# EAGLE design rambo_e2p (EAGLE 6.4)
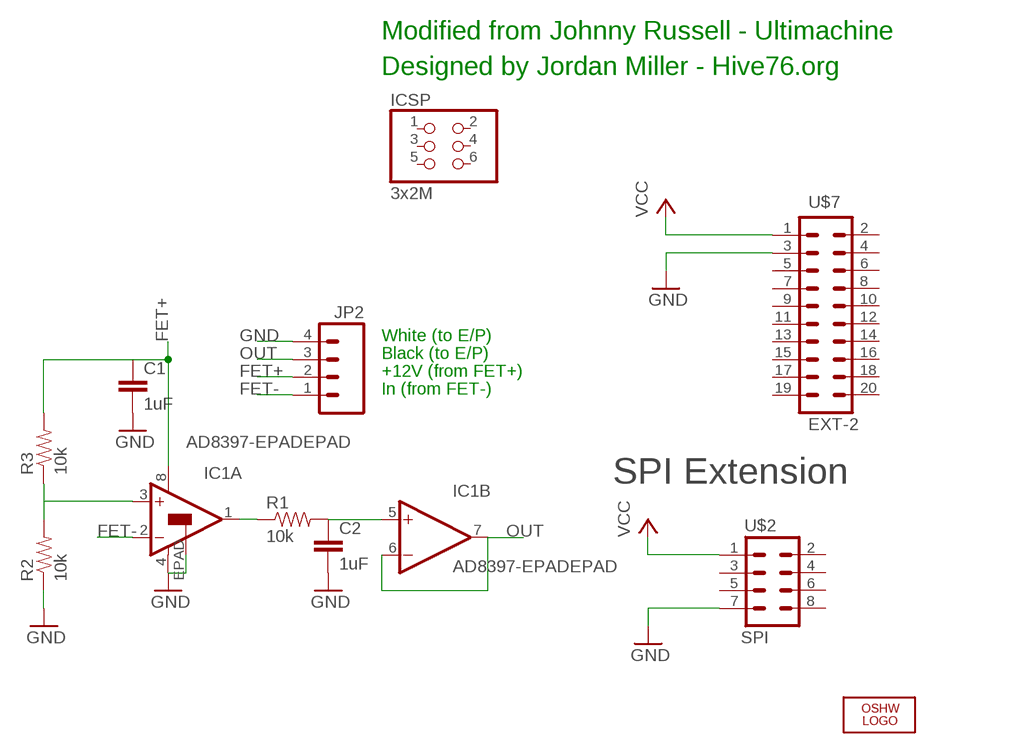
[diagram p0: schematic, sheet 1]

## Parts
C1  1uF  1UF-25V-10%(0805)  [0805]
C2  1uF  1UF-25V-10%(0805)  [0805]
IC1  AD8397-EPADEPAD  [SO08-EPAD]
ICSP  3x2M  PINHD-2X3  [2X03]
JP2  M04SCREW  [SCREWTERMINAL-3.5MM-4]
LOGO1  OSHW_LOGO_8MILX0150-NT  [OSHW_8X150_NOTEXT]
R1  10k  RESISTOR0805-RES  [0805]
R2  10k  RESISTOR0805-RES  [0805]
R3  10k  RESISTOR0805-RES  [0805]
U$2  SPI  M04X2  [2X4]
U$7  EXT-2  M10X2  [2X10]

## Nets
FET+: C1.1 IC1.8(A:V+) JP2.2 R3.2
FET-: IC1.2(A:-IN) JP2.1
GND [gnd]: C1.2 C2.2 IC1.4(A:V-) IC1.EPAD(A:EPAD) JP2.4 R2.1 U$2.7 U$7.3
N$1: IC1.1(A:OUT) R1.1
N$2: C2.1 IC1.5(B:+IN) R1.2
N$5: IC1.3(A:+IN) R2.2 R3.1
OUT: IC1.6(B:-IN) IC1.7(B:OUT) JP2.3
VCC: U$2.1 U$7.1
Unconnected: ICSP.1 ICSP.2 ICSP.3 ICSP.4 ICSP.5 ICSP.6 U$2.2 U$2.3 U$2.4 U$2.5 U$2.6 U$2.8 U$7.2 U$7.4 U$7.5 U$7.6 U$7.7 U$7.8 U$7.9 U$7.10 U$7.11 U$7.12 U$7.13 U$7.14 U$7.15 U$7.16 U$7.17 U$7.18 U$7.19 U$7.20

## Notes on the sheet
- Modified from Johnny Russell - Ultimachine
- Designed by Jordan Miller - Hive76.org
- White (to E/P)
- Black (to E/P)
- +12V (from FET+)
- In (from FET-)
- SPI Extension

## Library data of the parts
C1 C2 = SparkFun-Capacitors:1UF-25V-10%(0805): CAP-08064; PROD_ID: CAP-08064
IC1 = SparkFun-AnalogIC:AD8397-EPAD: Rail-to-rail high current output op-amp
ICSP = SmartPrj:PINHD-2X3: PIN HEADER
JP2 = SparkFun-Connectors:M04: Header 4 Standard 4-pin 0.1" header. Use with straight break away headers (SKU : PRT-00116), right angle break away headers (PRT-00553), swiss pins (PRT-00743), machine pins (PRT-00117), and female headers (PRT-00115). Molex polarized connector foot print use with SKU : PRT-08231 with associated crimp pins and housings. 1MM SMD Version SKU: PRT-10208
LOGO1 = ohw-logo:OSHW_LOGO_8MIL
R1-R3 = SparkFun-Resistors:RESISTOR: Resistor Basic schematic elements and footprints for 0603, 1206, and PTH resistors.
U$2 = SparkFun:M04X2
U$7 = SparkFun:M10X2: This was SPECIALLY designed to be used with our Graphic LCD Backpack. Be sure you want to use this! It is not only staggered on each line of header holes, but IT IS ALSO offset of the center point of the top and bottom lines by 5 mil. This causes the headers to lock into place on the "standard" footprint on the LCD screen. The extra squares on the tdocu layer are there simply to reference other pins (if you were to actually populate a longer header than ten long - this is what we do with the backpacks).

## Net classes
0 default: width 0.178 mm, drill 0.381 mm, clearance 0.178 mm
1 power: width 0.203 mm, drill 0.381 mm, clearance 0.178 mm
2 gnd: width 0.203 mm, drill 0.381 mm, clearance 0.178 mm
3 power usb: width 0.203 mm, drill 0.381 mm, clearance 0.178 mm

## Board
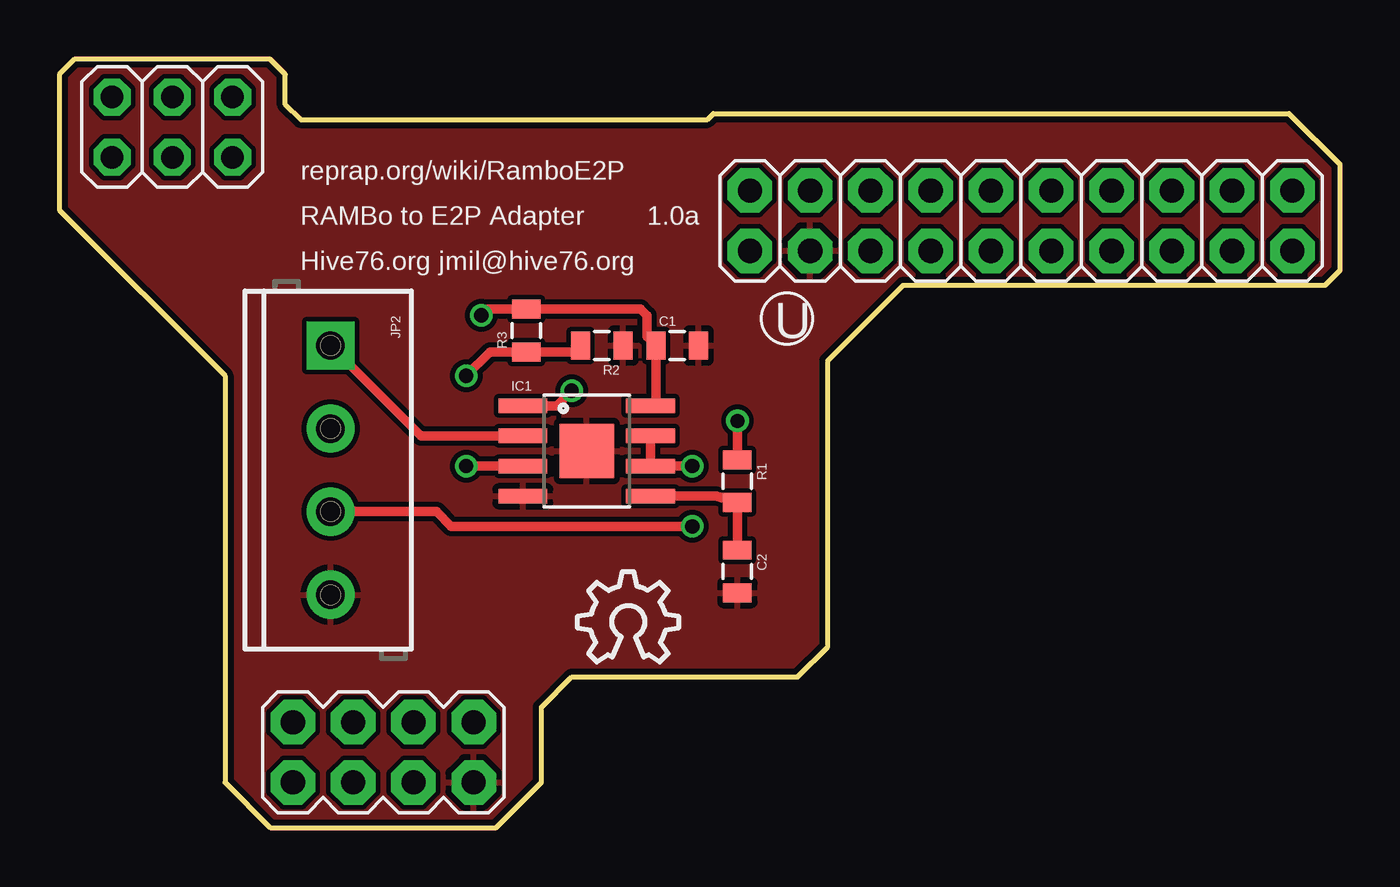
[diagram p1: board, top side]
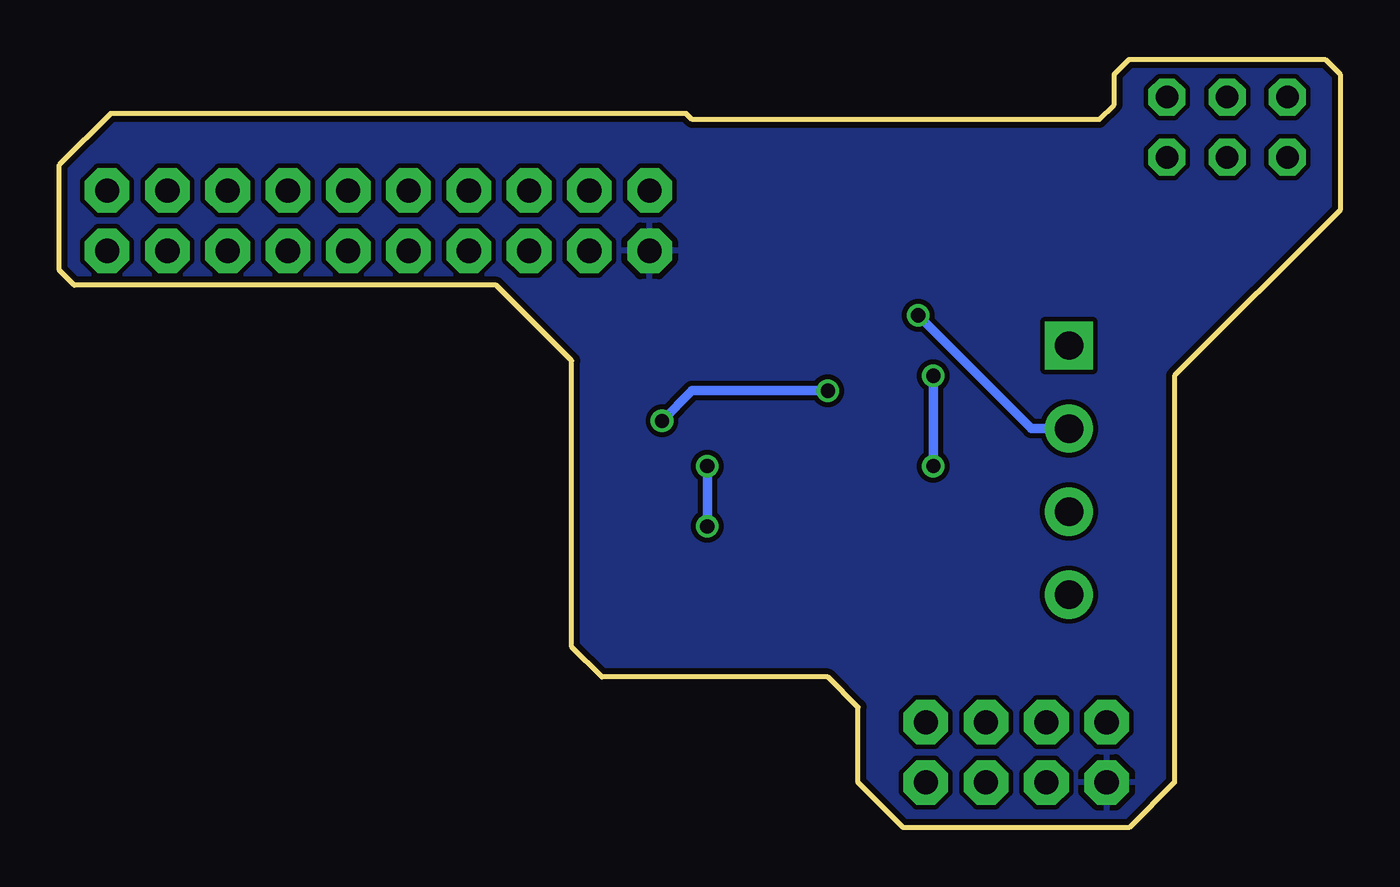
[diagram p2: board, bottom side, seen from below]

Size 53.98 x 32.38 mm. Coordinates in mm from the lower left corner, seen from the top.
Outline: 20.32,1.91 20.32,5.08 21.59,6.35 31.11,6.35 32.38,7.62 32.38,19.68 35.56,22.86 53.34,22.86 53.98,23.5 53.98,27.94 51.82,30.1 27.56,30.1 27.3,29.84 10.16,29.84 9.53,30.48 9.53,31.75 8.89,32.38 0.64,32.38 0,31.75 0,26.04 6.99,19.05 6.99,1.91 8.89,0 18.41,0 20.32,1.91
Copper layers (1*16): Top 0.035mm / dielectric 1.5mm / Bottom 0.035mm
Design rules "default": minimum track width 7mil, minimum drill 15mil, track to track 8mil, track to pad 8mil, pad to pad 7mil, via to via 7mil, smd to smd 7mil, copper to edge 10mil, drill to drill 8mil, minimum pad ring 12mil, minimum via ring 7mil, stop-mask expansion 4mil, vias tented up to drill 25mil, thermal gap 10mil

### Footprints (pad centres in the part's own frame; a part is rotated, then mirrored left to right if it is on the bottom)
0805 = smd 0.8 x 1.2: 1 -0.9,0; 2 0.9,0
SO08-EPAD = smd 0.61 x 2.057: 1 -1.905,-2.692; 2 -0.635,-2.692; 3 0.635,-2.692; 4 1.905,-2.692; 5 1.905,2.692; 6 0.635,2.692; 7 -0.635,2.692; 8 -1.905,2.692 | smd 2.286 x 2.286: EPAD 0,0
2X03 = drill 0.95 pad 1.55 octagon: 1 -2.54,-1.27; 2 -2.54,1.27; 3 0,-1.27; 4 0,1.27; 5 2.54,-1.27; 6 2.54,1.27
SCREWTERMINAL-3.5MM-4 = drill 1.2 pad 2.032 square: 1 0,0 | drill 1.2 pad 2.032: 2 3.5,0; 3 7,0; 4 10.5,0
2X4 = drill 1.016 pad 1.88 octagon: 1 -3.81,-1.27; 2 -3.81,1.27; 3 -1.27,-1.27; 4 -1.27,1.27; 5 1.27,-1.27; 6 1.27,1.27; 7 3.81,-1.27; 8 3.81,1.27
2X10 = drill 1.016 pad 1.88 octagon: 1 -11.43,-1.27; 2 -11.43,1.27; 3 -8.89,-1.27; 4 -8.89,1.27; 5 -6.35,-1.27; 6 -6.35,1.27; 7 -3.81,-1.27; 8 -3.81,1.27; 9 -1.27,-1.27; 10 -1.27,1.27; 11 1.27,-1.27; 12 1.27,1.27; 13 3.81,-1.27; 14 3.81,1.27; 15 6.35,-1.27; 16 6.35,1.27; 17 8.89,-1.27; 18 8.89,1.27; 19 11.43,-1.27; 20 11.43,1.27

### Placement (x,y rotation side)
C1  26.04,20.32 0 top
C2  28.57,10.79 270 top
IC1  22.23,15.88 270 top
ICSP  4.76,29.53 0 top
JP2  11.43,20.32 270 top
LOGO1  21.84,6.99 0 top
R1  28.57,14.61 270 top
R2  22.86,20.32 180 top
R3  19.68,20.95 90 top
U$2  13.65,3.17 0 top
U$7  40.53,25.58 0 top

### Tracks (layer width: path | path; a pad name or v marks a point on that pad's centre or on a via)
FET+  (via drill 0.6)
  Top 0.406: IC1.8 25.14,18 C1.1 24.77,20.69 24.77,21.59 24.5,21.86 R3.2 18.05,21.86 v17.78,21.59
  Bottom 0.406: JP2.2 13.01,16.82 v17.78,21.59
FET-
  Top 0.406: IC1.2 15.24,16.51 JP2.1
GND
  pour Top: 0.64,32.38 8.89,32.38 9.53,31.75 9.53,30.48 10.16,29.84 27.3,29.84 27.56,30.1 51.82,30.1 53.98,27.94 53.98,23.5 53.34,22.86 35.56,22.86 32.38,19.68 32.38,7.62 31.11,6.35 21.59,6.35 20.32,5.08 20.32,1.91 18.41,0 8.89,0 6.99,1.91 6.99,19.05 0,26.04 0,31.75
N$1  (via drill 0.6)
  Top 0.406: IC1.1 20.95,17.78 v21.59,18.41 | R1.1 v28.57,17.14
  Bottom 0.406: v21.59,18.41 27.3,18.41 v28.57,17.14
N$2
  Top 0.406: IC1.5 27.68,13.97 R1.2 C2.1
N$5  (via drill 0.6)
  Top 0.406: R2.2 21.7,20.05 R3.1 18.15,20.05 v17.14,19.05 | v17.14,15.24 IC1.3
  Bottom 0.406: v17.14,19.05 v17.14,15.24
OUT  (via drill 0.6)
  Top 0.406: IC1.7 IC1.6 v26.67,15.24 | JP2.3 15.89,13.32 16.51,12.7 v26.67,12.7
  Bottom 0.406: v26.67,15.24 v26.67,12.7
VCC
  pour Bottom: 0.64,32.38 8.89,32.38 9.53,31.75 9.53,30.48 10.16,29.84 27.3,29.84 27.56,30.1 51.82,30.1 53.98,27.94 53.98,23.5 53.34,22.86 35.56,22.86 32.38,19.68 32.38,7.62 31.11,6.35 21.59,6.35 20.32,5.08 20.32,1.91 18.41,0 8.89,0 6.99,1.91 6.99,19.05 0,26.04 0,31.75

### Text on the board
_tsilk: reprap.org/wiki/RamboE2P | RAMBo to E2P Adapter | 1.0a | Hive76.org jmil@hive76.org | U